# EAGLE design pagosaWifi_v1 (EAGLE 9.4.1)
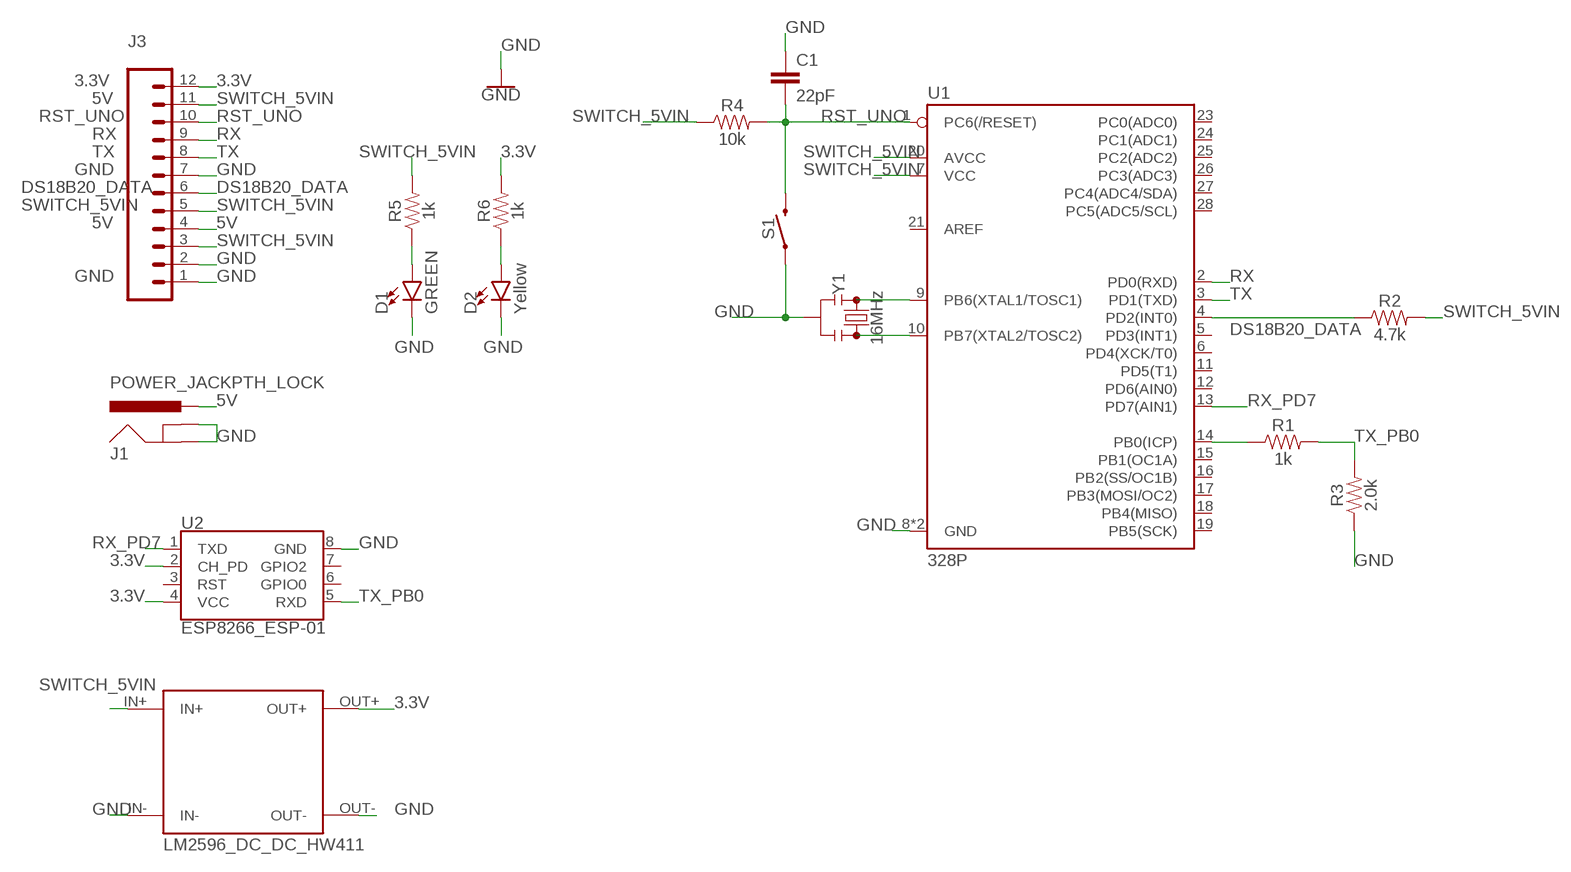
[diagram p0: schematic, sheet 1]

## Parts
C1  22pF  22PF-0603-50V-5%  [0603]
D1  GREEN  LED-GREEN0603  [LED-0603]
D2  Yellow  LED-YELLOW0603  [LED-0603]
J1  POWER_JACKPTH_LOCK  [POWER_JACK_PTH_LOCK]
J3  CONN_12  [1X12]
R1  1k  1KOHM-0603-1/10W-1%  [0603]
R2  4.7k  4.7KOHM-0603-1/10W-1%  [0603]
R3  2.0k  2.0KOHM-0603-1/10W-5%  [0603]
R4  10k  10KOHM-0603-1/10W-1%  [0603]
R5  1k  1KOHM-0603-1/10W-1%  [0603]
R6  1k  1KOHM-0603-1/10W-1%  [0603]
S1  MOMENTARY-SWITCH-SPST-PTH-6.0MM  [TACTILE_SWITCH_PTH_6.0MM]
U1  328P  ATMEGA328P_PDIP  [DIP28]
U2  ESP8266_ESP-01  [ESP8266_ESP-01]
U$1  LM2596_DC_DC_HW411  [LM2596_DC_DC_HW411]
Y1  16MHz  RESONATOR-16MHZSMD_3.2X1.3  [RESONATOR-SMD-3.2X1.3]

## Nets
3.3V: J3.12 R6.2 U2.2(CH_PD) U2.4(VCC) U$1.OUT+
5V: J1.PWR J3.4
DS18B20_DATA: J3.6 R2.1 U1.4(PD2(INT0))
GND: C1.1 D1.C D2.C J1.GND J1.GNDBREAK J3.1 J3.2 J3.7 R3.1 S1.1 U1.8(GND) U1.22(GND) U2.8(GND) U$1.IN- U$1.OUT- Y1.2
N$1: U1.9(PB6(XTAL1/TOSC1)) Y1.1
N$2: U1.10(PB7(XTAL2/TOSC2)) Y1.3
N$4: R1.1 U1.14(PB0(ICP))
N$5: D1.A R5.1
N$6: D2.A R6.1
RST_UNO: C1.2 J3.10 R4.2 S1.3 U1.1(PC6(/RESET))
RX: J3.9 U1.2(PD0(RXD))
RX_PD7: U1.13(PD7(AIN1)) U2.1(TXD)
SWITCH_5VIN: J3.3 J3.5 J3.11 R2.2 R4.1 R5.2 U1.7(VCC) U1.20(AVCC) U$1.IN+
TX: J3.8 U1.3(PD1(TXD))
TX_PB0: R1.2 R3.2 U2.5(RXD)
Unconnected: U1.5(PD3(INT1)) U1.6(PD4(XCK/T0)) U1.11(PD5(T1)) U1.12(PD6(AIN0)) U1.15(PB1(OC1A)) U1.16(PB2(SS/OC1B)) U1.17(PB3(MOSI/OC2)) U1.18(PB4(MISO)) U1.19(PB5(SCK)) U1.21(AREF) U1.23(PC0(ADC0)) U1.24(PC1(ADC1)) U1.25(PC2(ADC2)) U1.26(PC3(ADC3)) U1.27(PC4(ADC4/SDA)) U1.28(PC5(ADC5/SCL)) U2.3(RST) U2.6(GPIO0) U2.7(GPIO2)

## Notes on the sheet
- 3.3V
- 5V
- RST_UNO
- RX
- TX
- GND
- DS18B20_DATA
- SWITCH_5VIN
- 5V
- GND

## Library data of the parts
C1 = SparkFun-Capacitors:22PF: 22pF ceramic capacitors A capacitor is a passive two-terminal electrical component used to store electrical energy temporarily in an electric field.; PROD_ID: CAP-07876
D1 = SparkFun-LED:LED-GREEN: Green SMD LED Used in manufacturing of various products at SparkFun Packages: 0603 - SMD 0603 package [Product Link] <http://www.futureelectronics.com/en/technologies/semiconductors/optoelectronics/leds/Pages/9894312-LTST-C190GKT.aspx?CrossPart=HSMG-C190&IM=0> LilyPad 1206 - SMD1206 LilyPad package [Product Link] <http://www.futureelectronics.com/en/Technologies/Product.aspx?ProductID=IN150NGHARVATEKCORPORATION2049943&IM=0> 1206 - SMD1206 package [Product Link] <http://www.futureelectronics.com/en/technologies/semiconductors/optoelectronics/leds/Pages/8315665-LTST-C150KGKT.aspx?IM=0> 1206 Bottom Mount -SMD 1206 Bottom Mount [Product Link] <http://www.digikey.com/product-detail/en/lite-on-inc/LTST-C230KGKT/160-1456-1-ND/386854> SparkFun Products: Pro Mini 328 -5V <https://www.sparkfun.com/products/821> RedBoard <https://www.sparkfun.com/products/12757> MP3 Trigger <https://www.sparkfun.com/products/13720> Makey Makey <https://www.sparkfun.com/products/11076>; PROD_ID: DIO-00821
D2 = SparkFun-LED:LED-YELLOW: Yellow SMD LED Used in manufacturing several products at SparkFun. Packages: 0603 - SMD 0603 package[Product Link] <http://www.kingbrightusa.com/product.asp?catalog_name=LED&product_id=APT1608SYCK> 0603 -SMART - SMART SMD 0603 package (more efficient/more expensive) [Product Link] <http://www.osram-os.com/osram_os/en/products/product-catalog/led-light-emitting-diodes/smartled-0603/ly-l29k/index.jsp> LilyPad - SMD1206 package[Product Datasheet] <https://www.sparkfun.com/datasheets/DevTools/LilyPad/Q150YUS4.pdf> SparkFun Products: Blynk Board <https://www.sparkfun.com/products/13794> IOIO-OTG <https://www.sparkfun.com/products/13613> XBee Explorer Serial <https://www.sparkfun.com/products/13225>; PROD_ID: DIO-09003
J1 = SparkFun-Connectors:POWER_JACK: Power Jack Connector This is the standard 5.5mm barrel jack for power. The PTH is the most common, proven, reliable, footprint. The Slot footprint only works if the mill layer is transmitted to the PCB fab house so be warned. Here are the connectors we sell at SparkFun: DC Barrel Power Jack/Connector <https://www.sparkfun.com/products/119> (PRT-00119) DC Barrel Power Jack/Connector (SMD) <https://www.sparkfun.com/products/12748> (PRT-12748) DC Barrel Jack Adapter - Breadboard Compatible <https://www.sparkfun.com/products/10811> (PRT-10811) It is used on this SparkFun product (and many, many others): SparkFun RedBoard - Programmed with Arduino <https://www.sparkfun.com/products/12757> (DEV-12757) Also, if you need a mating power supply or connector, please check these out: Wall Adapter Power Supply - 9VDC 650mA <https://www.sparkfun.com/products/298> (TOL-00298) DC Barrel Jack Adapter - Male <https://www.sparkfun.com/products/10287> (PRT-10287); PROD_ID: CONN-08197; SF_ID: PRT-00119
J3 = SparkFun-Connectors:CONN_12: Multi connection point. Often used as Generic Header-pin footprint for 0.1 inch spaced/style header connections On any of the 0.1 inch spaced packages, you can populate with these: Break Away Headers - Straight <https://www.sparkfun.com/products/116> (PRT-00116) Break Away Male Headers - Right Angle <https://www.sparkfun.com/products/553> (PRT-00553) Female Headers <https://www.sparkfun.com/products/115> (PRT-00115) Break Away Headers - Machine Pin <https://www.sparkfun.com/products/117> (PRT-00117) Break Away Female Headers - Swiss Machine Pin <https://www.sparkfun.com/products/743> (PRT-00743) For SCREWTERMINALS and SPRING TERMINALS visit here: Screw Terimnals on SparkFun.com <https://www.sparkfun.com/search/results?term=Screw+Terminals> (5mm/3.5mm/2.54mm spacing) This device is also useful as a general connection point to wire up your design to another part of your project. Our various solder wires solder well into these plated through hole pads. Hook-Up Wire - Assortment (Stranded, 22 AWG) <https://www.sparkfun.com/products/11375> (PRT-11375) Hook-Up Wire - Assortment (Solid Core, 22 AWG) <https://www.sparkfun.com/products/11367> (PRT-11367) View the entire wire category on our website here <https://www.sparkfun.com/categories/141> Special notes: Molex polarized connector foot print use with SKU : PRT-08231 with associated crimp pins and housings. 1MM SMD Version SKU: PRT-10208 NOTES ON THE VARIANTS LOCK and LOCK_LONGPADS... This footprint was designed to help hold the alignment of a through-hole component (i.e. 6-pin header) while soldering it into place. You may notice that each hole has been shifted either up or down by 0.005 of an inch from it's more standard position (which is a perfectly straight line). This slight alteration caused the pins (the squares in the middle) to touch the edges of the holes. Because they are alternating, it causes a "brace" to hold the component in place. 0.005 has proven to be the perfect amount of "off-center" position when using our standard breakaway headers. Although looks a little odd when you look at the bare footprint, once you have a header in there, the alteration is very hard to notice. Also,if you push a header all the way into place, it is covered up entirely on the bottom side.
R1 R5 R6 = SparkFun-Resistors:1KOHM: 1kΩ resistor A resistor is a passive two-terminal electrical component that implements electrical resistance as a circuit element. Resistors act to reduce current flow, and, at the same time, act to lower voltage levels within circuits. - Wikipedia; PROD_ID: RES-07856
R2 = SparkFun-Resistors:4.7KOHM: 4.7kΩ resistor A resistor is a passive two-terminal electrical component that implements electrical resistance as a circuit element. Resistors act to reduce current flow, and, at the same time, act to lower voltage levels within circuits. - Wikipedia; PROD_ID: RES-07857
R3 = SparkFun-Resistors:2.0KOHM: 2kΩ resistor A resistor is a passive two-terminal electrical component that implements electrical resistance as a circuit element. Resistors act to reduce current flow, and, at the same time, act to lower voltage levels within circuits. - Wikipedia; PROD_ID: RES-08296
R4 = SparkFun-Resistors:10KOHM: 10kΩ resistor A resistor is a passive two-terminal electrical component that implements electrical resistance as a circuit element. Resistors act to reduce current flow, and, at the same time, act to lower voltage levels within circuits. - Wikipedia; PROD_ID: RES-00824
S1 = SparkFun-Switches:MOMENTARY-SWITCH-SPST: Momentary Switch (Pushbutton) - SPST Normally-open (NO) SPST momentary switches (buttons, pushbuttons). Variants PTH-12MM - 12mm square, through-hole Momentary Pushbutton Switch - 12mm Square <https://www.sparkfun.com/products/9190> (COM-09190) PTH-6.0MM, PTH-6.0MM-KIT - 6.0mm square, through-hole Mini Pushbutton Switch <https://www.sparkfun.com/products/97> (COM-00097) KIT package intended for soldering kit's - only one side of pads' copper is exposed. PTH-RIGHT-ANGLE-KIT - Right-angle, through-hole Right Angle Tactile Button <https://www.sparkfun.com/products/10791> - Used on SparkFun BigTime Watch Kit <https://www.sparkfun.com/products/11734> SMD-12MM - 12mm square, surface-mount Tactile Button - SMD (12mm) <https://www.sparkfun.com/products/12993> (COM-12993) Used on SparkFun PicoBoard <https://www.sparkfun.com/products/11888> SMD-4.5MM - 4.5mm Square Trackball Switch Used on SparkFun Blackberry Trackballer Breakout <https://www.sparkfun.com/products/13169> SMD-4.6MMX2.8MM - 4.60mm x 2.80mm, surface mount Used on SparkFun SAMD21 Mini Breakout <https://www.sparkfun.com/products/13664> SMD-5.2MM, SMD-5.2-REDUNDANT - 5.2mm square, surface-mount Mini Pushbutton Switch - SMD <https://www.sparkfun.com/products/8720> (COM-08720) Used on Arduino Pro Mini <https://www.sparkfun.com/products/11114> REDUNDANT package connects both switch circuits together SMD-6.0X3.5MM - 6.0 x 3.5mm, surface mount Momentary Reset Switch SMD <https://www.sparkfun.com/products/8229> (COM-08229) SMD-6.2MM-TALL - 6.2mm square, surface mount Tactile Button - SMD (6mm) <https://www.sparkfun.com/products/12992> Used on SparkFun Digital Sandbox <https://www.sparkfun.com/products/12651> SMD-RIGHT-ANGLE - Right-angle, surface mount Used on SparkFun Block for Intel® Edison - Arduino <https://www.sparkfun.com/products/13036>; PROD_ID: SWCH-08441; SF_SKU: COM-00097
U1 = SparkFun-IC-Microcontroller:ATMEGA328P_PDIP: Atmel 328P Through hole ATMEGA328P uC used in the Arduino 32kb flash, 1k EEPROM, 2k SRAM Datasheet <http://www.sparkfun.com/datasheets/Components/SMD/ATMega328.pdf> SparkFun Products Storefront component: AVR 28 Pin 20MHz 32K 6A/D - ATMega328P <https://www.sparkfun.com/products/9061> (COM-09061) SparkFun Simon Says - Through-Hole Soldering Kit <https://www.sparkfun.com/products/10547> (KIT-10547) SparkFun Learn to Solder - Simon Says <https://www.sparkfun.com/products/13708> (KIT-13708) SparkFun BigTime Watch Kit <https://www.sparkfun.com/products/11734> (KIT-11734) SparkFun ClockIt <https://www.sparkfun.com/products/10930> (KIT-10930) SparkFun Serial Enabled LCD Kit <https://www.sparkfun.com/products/10097> (LCD-10097) SparkFun Simon Tilts - Through Hole Soldering Kit <https://www.sparkfun.com/products/12634> (KIT-12634) SparkFun Frequency Counter Kit <https://www.sparkfun.com/products/10140> (KIT-10140) FabFM Radio Kit <https://www.sparkfun.com/products/11043> (KIT-11043) SparkFun Binary Blaster Kit <https://www.sparkfun.com/products/12037> (KIT-12037) SparkFun Metro-Gnome <https://www.sparkfun.com/products/9236> (KIT-09236) ATmega328 with Arduino Optiboot (Uno) <https://www.sparkfun.com/products/10524> (DEV-10524); PROD_ID: IC-09136
U2 = SparkFun-RF:ESP8266_ESP-01: ESP8266 ESP-01 Module The ESP8266 WiFi Module is a self contained SOC with integrated TCP/IP protocol stack that can give any microcontroller access to your WiFi network. The ESP8266 is capable of either hosting an application or offloading all Wi-Fi networking functions from another application processor. Each ESP8266 module comes pre-programmed with an AT command set firmware, meaning, you can simply hook this up to your Arduino device and get about as much WiFi-ability as a WiFi Shield offers (and that’s just out of the box)! The ESP8266 module is an extremely cost effective board with a huge, and ever growing, community. This module has a powerful enough on-board processing and storage capability that allows it to be integrated with the sensors and other application specific devices through its GPIOs with minimal development up-front and minimal loading during runtime. Its high degree of on-chip integration allows for minimal external circuitry, including the front-end module, is designed to occupy minimal PCB area. The ESP8266 supports APSD for VoIP applications and Bluetooth co-existance interfaces, it contains a self-calibrated RF allowing it to work under all operating conditions, and requires no external RF parts. SparkFun Product Page <https://www.sparkfun.com/products/13678>; SF_ID: WRL-13678
U$1 = YL_Power:LM2596_DC_DC_HW411: This is the DC-DC module (Adjustable) pin map for the Pagosa Wifi project. There are only four pins for this module.
Y1 = SparkFun-Clocks:RESONATOR-16MHZ: 16MHz Resonator Digikey Example <http://www.digikey.com/product-detail/en/murata-electronics-north-america/CSTCE16M0V53-R0/490-1198-1-ND/584635> Frequency: 16MHz Frequency Stability: ±0.3% Frequency Tolerance: ±0.5% Capacitance: 15pF SparkFun Products SparkFun OpenLog <https://www.sparkfun.com/products/13712> SparkFun MicroView - OLED Arduino Module <https://www.sparkfun.com/products/12923>; PROD_ID: XTAL-08900; SPICEPREFIX: Y

## Board
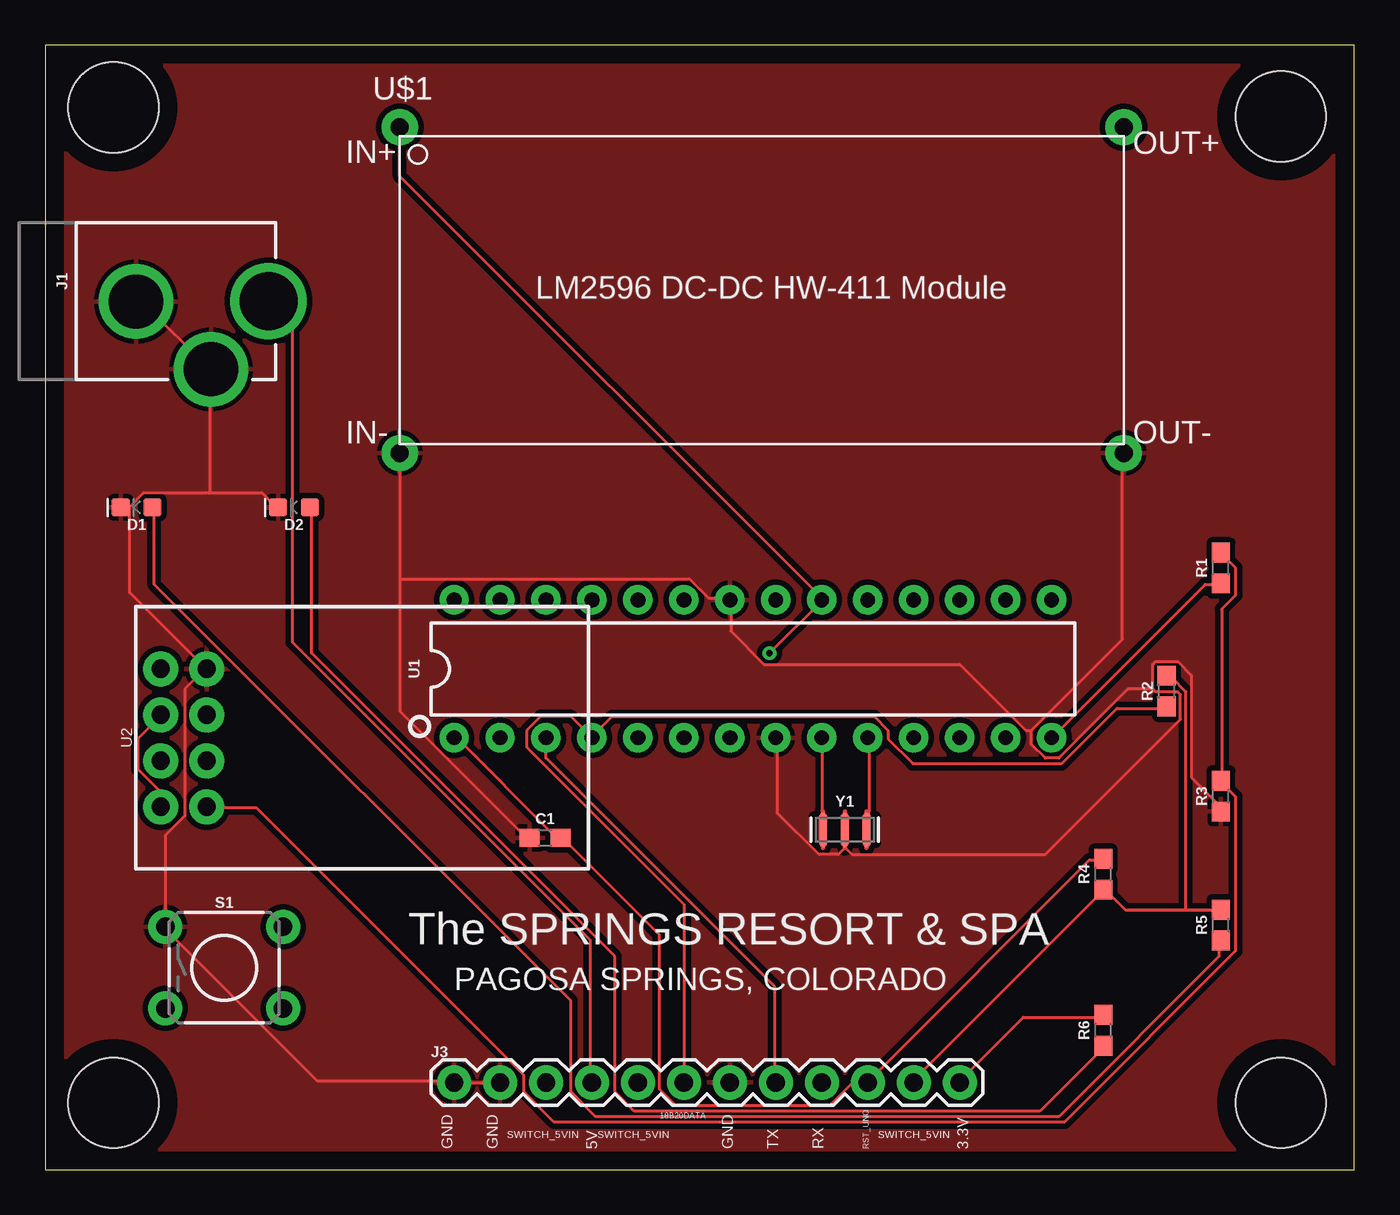
[diagram p1: board, top side]
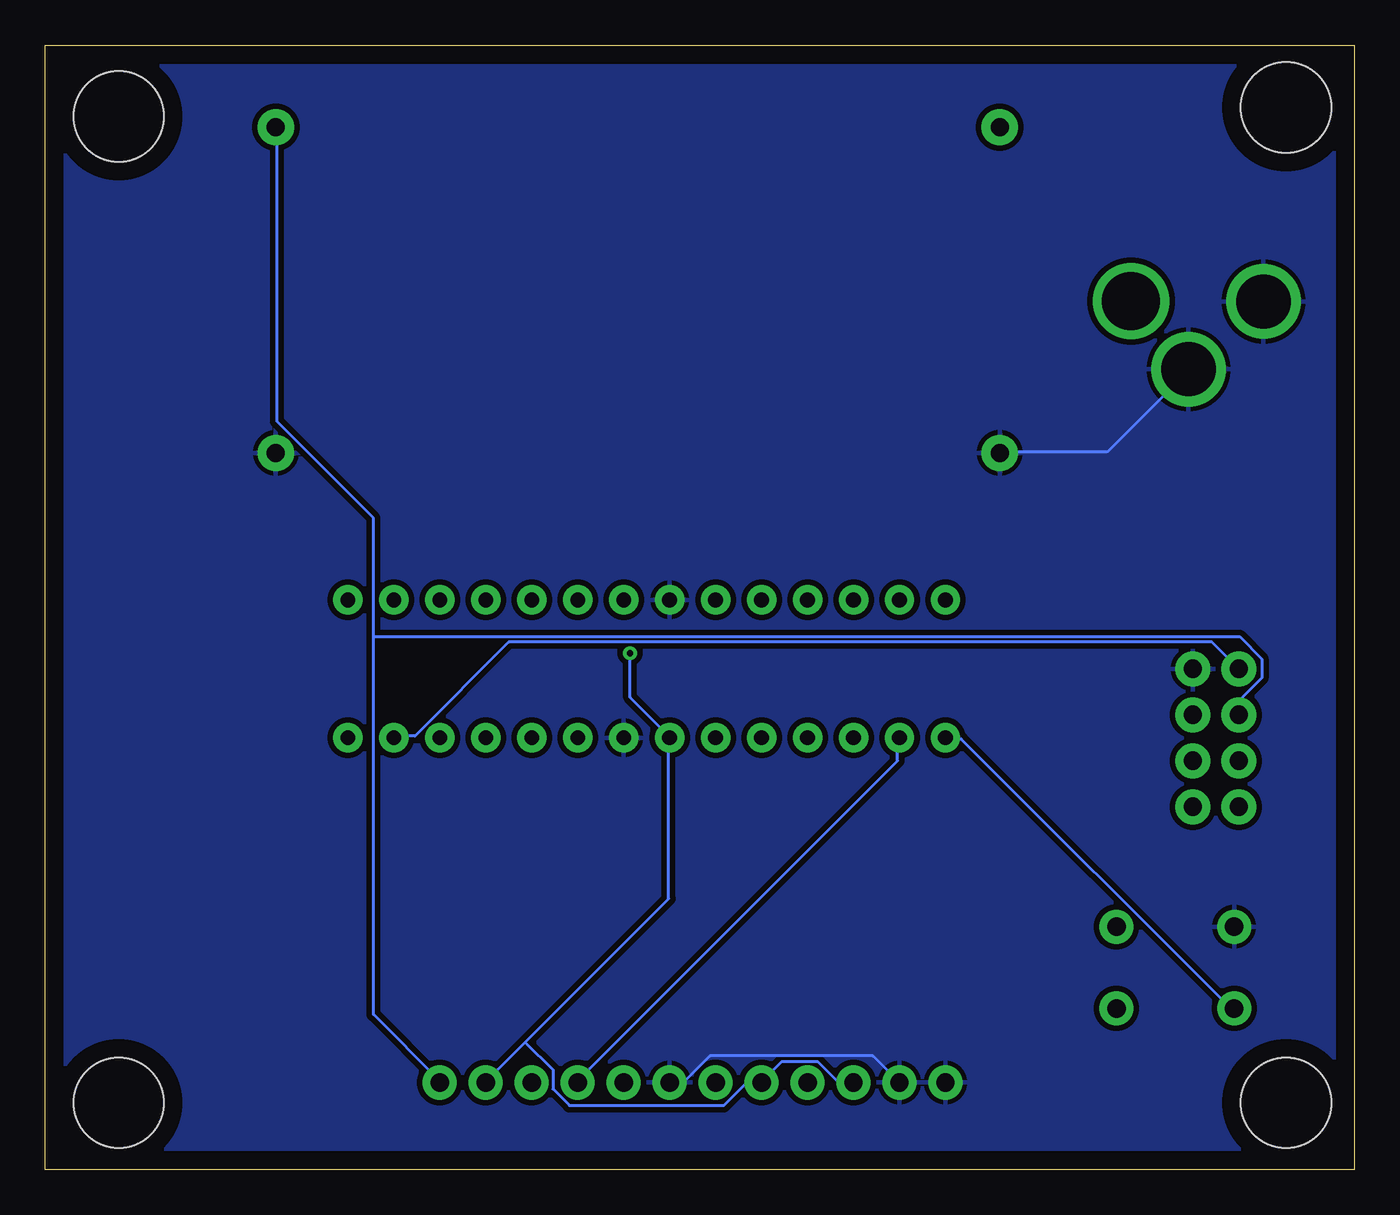
[diagram p2: board, bottom side, seen from below]

Size 72.33 x 62.13 mm. Coordinates in mm from the lower left corner, seen from the top.
Outline: 0,0 72.33,0 72.33,62.13 0,62.13 0,0
Copper layers (1*16): Top 0.035mm / dielectric 1.5mm / Bottom 0.035mm
Design rules "default": minimum track width 6mil, minimum drill 0.35mm, track to track 6mil, track to pad 6mil, pad to pad 6mil, via to via 6mil, smd to smd 6mil, copper to edge 40mil, drill to drill 6mil, minimum pad ring 10mil, minimum via ring 8mil, stop-mask expansion 4mil, vias tented up to drill 0mil, thermal gap 10mil
Holes 5 mm at 3.77,58.69 68.27,58.19 3.77,3.69 68.27,3.69

### Footprints (pad centres in the part's own frame; a part is rotated, then mirrored left to right if it is on the bottom)
0603 = smd 1.1 x 1: 1 -0.85,0; 2 0.85,0
LED-0603 = smd 1 x 1: A -0.877,0; C 0.877,0
POWER_JACK_PTH_LOCK = drill 2.997 pad 4.115: GND 0.025,6.557; GNDBREAK 3.762,10.7 | drill 3.2 pad 4.115: PWR 0,13.878
1X12 = drill 1.016 pad 1.88: 1 0,0; 2 2.54,0; 3 5.08,0; 4 7.62,0; 5 10.16,0; 6 12.7,0; 7 15.24,0; 8 17.78,0; 9 20.32,0; 10 22.86,0; 11 25.4,0; 12 27.94,0
TACTILE_SWITCH_PTH_6.0MM = drill 1.016 pad 1.88: 1 -3.251,2.261; 2 3.251,2.261; 3 -3.251,-2.261; 4 3.251,-2.261
DIP28 = drill 0.813 pad 1.626: 1 -16.51,-3.81; 2 -13.97,-3.81; 3 -11.43,-3.81; 4 -8.89,-3.81; 5 -6.35,-3.81; 6 -3.81,-3.81; 7 -1.27,-3.81; 8 1.27,-3.81; 9 3.81,-3.81; 10 6.35,-3.81; 11 8.89,-3.81; 12 11.43,-3.81; 13 13.97,-3.81; 14 16.51,-3.81; 15 16.51,3.81; 16 13.97,3.81; 17 11.43,3.81; 18 8.89,3.81; 19 6.35,3.81; 20 3.81,3.81; 21 1.27,3.81; 22 -1.27,3.81; 23 -3.81,3.81; 24 -6.35,3.81; 25 -8.89,3.81; 26 -11.43,3.81; 27 -13.97,3.81; 28 -16.51,3.81
ESP8266_ESP-01 = drill 1.016 pad 1.93: 1 -3.81,-11.13; 2 -1.27,-11.13; 3 1.27,-11.13; 4 3.81,-11.13; 5 3.81,-8.59; 6 1.27,-8.59; 7 -1.27,-8.59; 8 -3.81,-8.59
LM2596_DC_DC_HW411 = drill 1 pad 2: IN+ 0,18; IN- 0,0; OUT+ 40,18; OUT- 40,0
RESONATOR-SMD-3.2X1.3 = smd 0.45 x 1.905: 1 -1.2,0; 2 0,0; 3 1.2,0

### Placement (x,y rotation side)
C1  27.62,18.33 0 top
D1  5.05,36.59 180 top
D2  13.74,36.59 180 top
J1  -1.54,47.99 270 top
J3  22.59,4.81 0 top
R1  64.96,33.25 90 top
R2  61.96,26.44 90 top
R3  64.96,20.63 90 top
R4  58.46,16.32 90 top
R5  64.96,13.51 90 top
R6  58.46,7.7 90 top
S1  9.89,11.16 0 top
U1  39.1,27.67 0 top
U2  17.51,23.86 270 top
U$1  19.59,39.6 0 top
Y1  44.18,18.78 0 top

### Tracks (layer width: path | path; a pad name or v marks a point on that pad's centre or on a via)
3.3V
  Top 0.152: U2.4 6.33,20.15 6.33,20.91 5.12,22.13 5.12,23.81 6.33,25.03 U2.2 | R6.2 58.45,8.42 54.03,8.42 50.53,4.91 J3.12
  Bottom 0.152: 54.19,29.45 54.19,8.57 50.53,4.91 J3.12 | 54.19,29.45 54.19,36 59.52,41.34 59.52,57.49 U$1.OUT+ | 54.19,29.45 6.33,29.45 5.12,28.23 5.12,27.16 6.33,25.94 6.33,25.18 U2.2
5V
  Top 0.152: J3.4 30.11,4.91 30.11,12.68 13.65,29.14 13.65,46.67 12.43,47.89 J1.PWR
DS18B20_DATA
  Top 0.152: R2.1 61.96,25.49 59.22,25.49 56.17,22.44 47.94,22.44 46.57,23.81 46.57,24.27 45.81,25.03 31.33,25.03 30.26,23.96 U1.4 29.04,25.03 27.36,25.03 26.6,24.27 26.6,23.35 35.29,14.67 J3.6
GND
  Top 0.152: 61.2,26.55 61.2,27.92 61.35,28.08 62.57,28.08 63.33,27.31 63.33,21.68 64.86,20.15 64.86,19.85 R3.1 | 61.2,26.55 61.35,26.4 62.57,26.4 62.72,26.25 62.72,24.88 55.25,17.41 44.59,17.41 44.28,17.71 44.18,17.76 43.82,17.41 42.76,17.41 40.47,19.69 40.47,23.81 U1.8 | 54.49,24.27 59.52,29.3 59.52,39.51 U$1.OUT- | 54.49,24.27 54.49,23.5 55.25,22.74 56.02,22.74 59.83,26.55 61.2,26.55 | 19.59,32.65 19.59,39.51 U$1.IN- | 19.59,32.65 19.59,25.33 26.45,18.47 26.76,18.47 C1.1 | 19.59,32.65 35.59,32.65 36.66,31.58 37.73,31.58 U1.22 37.88,31.43 37.88,29.75 39.71,27.92 50.53,27.92 54.19,24.27 54.49,24.27 | 4.66,36.61 4.2,36.61 D1.C 4.66,36.61 | 4.66,36.61 5.42,37.37 9.08,37.37 | 9.08,37.37 11.97,37.37 12.73,36.61 D2.C | 9.08,37.37 9.08,44.08 J1.GNDBREAK 9.08,44.23 5.42,47.89 5.12,47.89 J1.GND | J3.2 25.08,4.76 22.64,4.76 J3.1 22.49,4.91 15.02,4.91 6.64,13.29 S1.1 6.64,18.47 7.71,19.54 7.71,26.55 8.77,27.62 U2.8 8.77,27.77 4.66,31.89 4.66,36.61
  Bottom 0.152: J3.2 26.6,6.28 35.59,6.28 36.97,4.91 37.73,4.91 J3.7 | U$1.IN- 19.44,39.66 13.65,39.66 9.23,44.08 J1.GNDBREAK
  pour Top (isolate 0.305): 0,62.13 0,0.13 72,0.13 72,62.13
  pour Bottom (isolate 0.305): 0,0.13 72.5,0.13 72.5,62.13 0.5,62.13 0,61.63
N$1
  Top 0.152: U1.9 42.91,19.85 Y1.1
N$2
  Top 0.152: Y1.3 45.5,19.85 45.5,23.81 U1.10
N$4
  Top 0.152: U1.14 64.09,32.34 64.86,32.34 R1.1
N$5
  Top 0.152: D1.A 6.03,36.46 6.03,32.34 29.04,9.33 29.04,4.3 30.41,2.93 56.02,2.93 64.86,11.77 64.86,12.53 R5.1
N$6
  Top 0.152: D2.A 14.72,36.46 14.72,28.53 31.48,11.77 31.48,4.3 32.55,3.23 54.95,3.23 58.45,6.74 R6.1
RST_UNO
  Top 0.152: R4.2 58.45,17.1 57.69,17.1 45.5,4.91 J3.10 45.35,4.76 44.59,4.76 43.37,3.54 34.83,3.54 33.92,4.45 33.92,12.99 28.58,18.32 C1.2 28.43,18.47 28.13,18.47 22.64,23.96 U1.1
  Bottom 0.152: S1.3 6.64,9.03 6.94,9.03 21.73,23.81 22.49,23.81 U1.1
RX
  Bottom 0.152: U1.2 25.23,23.81 25.23,22.59 42.91,4.91 J3.9
RX_PD7
  Bottom 0.152: U1.13 52.97,23.96 51.9,23.96 46.72,29.14 7.86,29.14 6.49,27.77 U2.1
SWITCH_5VIN  (via drill 0.35)
  Top 0.152: 63.03,14.36 59.67,14.36 58.61,15.43 R4.1 58.45,15.43 47.94,4.91 J3.11 | 63.03,14.36 64.86,14.36 R5.2 | 63.03,14.36 63.03,26.4 62.27,27.16 61.96,27.16 R2.2 | v40.01,28.53 42.91,31.43 U1.20 42.91,31.58 19.59,54.9 19.59,57.49 U$1.IN+
  Bottom 0.152: J3.3 27.67,4.91 28.58,4.91 29.65,5.98 31.63,5.98 32.7,4.91 J3.5 32.85,4.76 33.61,4.76 34.83,3.54 43.37,3.54 44.28,4.45 44.28,5.52 45.81,7.04 | 45.81,7.04 47.94,4.91 J3.11 | 45.81,7.04 37.88,14.97 37.88,23.81 U1.7 37.88,23.96 40.01,26.09 v40.01,28.53
TX
  Top 0.152: U1.3 27.67,22.74 40.32,10.09 40.32,4.91 J3.8
TX_PB0
  Top 0.152: R1.2 65.01,34.02 65.77,33.26 65.77,31.73 65.01,30.97 65.01,21.52 R3.2 65.01,21.37 65.77,20.61 65.77,12.07 56.32,2.63 28.13,2.63 26.45,4.3 26.45,5.22 11.67,20 8.93,20 U2.5

### Text on the board
tPlace: The SPRINGS RESORT & SPA | PAGOSA SPRINGS, COLORADO | 18B20DATA | SWITCH_5VIN | SWITCH_5VIN | SWITCH_5VIN | GND | GND | 5V | GND | TX | RX | RST_UNO | 3.3V